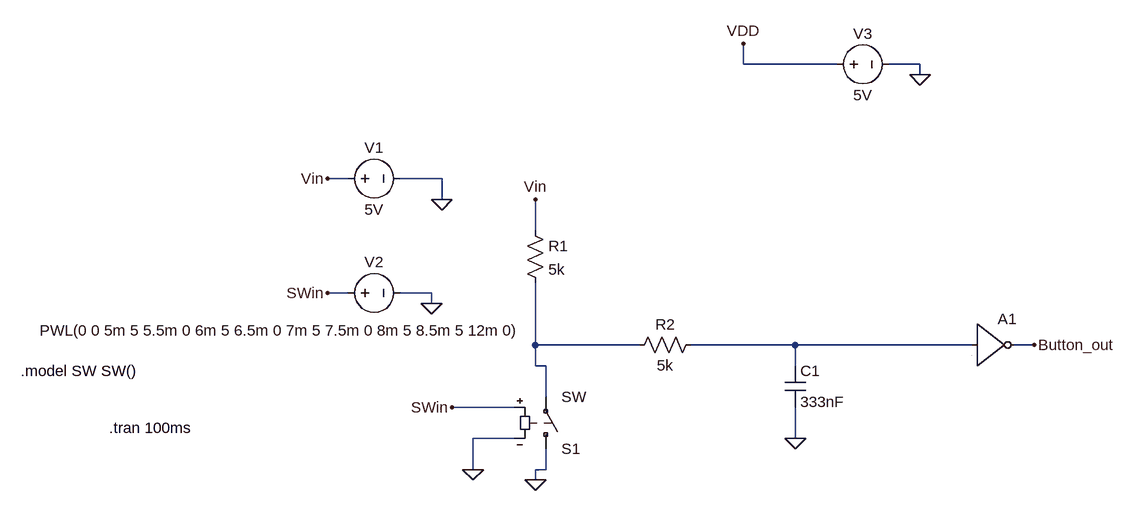
[diagram p0: schematic RESET.asc]
RESET.asc, the LTspice schematic file:
Version 4.1
SHEET 1 1508 1040
WIRE 608 -80 608 -112
WIRE 752 -80 608 -80
WIRE 880 -80 832 -80
WIRE 880 -64 880 -80
WIRE 0 96 -32 96
WIRE 144 96 80 96
WIRE 144 128 144 96
WIRE 288 176 288 128
WIRE 0 272 -32 272
WIRE 128 272 80 272
WIRE 128 288 128 272
WIRE 288 352 288 256
WIRE 448 352 288 352
WIRE 688 352 528 352
WIRE 960 352 688 352
WIRE 1056 352 1024 352
WIRE 288 384 288 352
WIRE 304 384 288 384
WIRE 688 384 688 352
WIRE 304 432 304 384
WIRE 256 448 160 448
WIRE 256 496 192 496
WIRE 688 496 688 448
WIRE 192 544 192 496
WIRE 304 544 304 512
WIRE 304 544 288 544
WIRE 288 560 288 544
FLAG 688 496 0
FLAG 288 560 0
FLAG 144 128 0
FLAG -32 96 Vin
FLAG 288 128 Vin
FLAG 128 288 0
FLAG -32 272 SWin
FLAG 160 448 SWin
FLAG 192 544 0
FLAG 1056 352 Button_out
FLAG 608 -112 VDD
FLAG 880 -64 0
SYMBOL voltage -16 96 R270
WINDOW 0 32 56 VTop 2
WINDOW 3 -32 56 VBottom 2
WINDOW 123 0 0 Left 0
WINDOW 39 0 0 Left 0
SYMATTR InstName V1
SYMATTR Value 5V
SYMBOL res 272 160 R0
SYMATTR InstName R1
SYMATTR Value 5k
SYMBOL res 544 336 R90
WINDOW 0 0 56 VBottom 2
WINDOW 3 32 56 VTop 2
SYMATTR InstName R2
SYMATTR Value 5k
SYMBOL cap 672 384 R0
SYMATTR InstName C1
SYMATTR Value 333nF
SYMBOL sw 304 528 M180
SYMATTR InstName S1
SYMBOL voltage -16 272 R270
WINDOW 0 32 56 VTop 2
WINDOW 3 -42 -87 VBottom 2
WINDOW 123 0 0 Left 0
WINDOW 39 0 0 Left 0
SYMATTR InstName V2
SYMATTR Value PWL(0 0 5m 5 5.5m 0 6m 5 6.5m 0 7m 5 7.5m 0 8m 5 8.5m 5 12m 0)
SYMBOL Digital\\inv 960 288 R0
WINDOW 123 8 60 Left 2
SYMATTR InstName A1
SYMBOL voltage 736 -80 R270
WINDOW 0 32 56 VTop 2
WINDOW 3 -32 56 VBottom 2
WINDOW 123 0 0 Left 0
WINDOW 39 0 0 Left 0
SYMATTR InstName V3
SYMATTR Value 5V
TEXT -504 392 Left 2 !.model SW SW()
TEXT -368 480 Left 2 !.tran 100ms

The netlist it stands for:
* RESET.asc
V1 Vin 0 5V
R1 Vin N001 5k
R2 N002 N001 5k
C1 N002 0 333nF
S1 0 N001 SWin 0 SW
V2 SWin 0 PWL(0 0 5m 5 5.5m 0 6m 5 6.5m 0 7m 5 7.5m 0 8m 5 8.5m 5 12m 0)
A1 N002 0 0 0 0 Button_out 0 0 BUF
V3 VDD 0 5V
.model SW SW()
.tran 100ms
.backanno
.end